# EAGLE board final_schematic (EAGLE 5.09), part 1 of 2
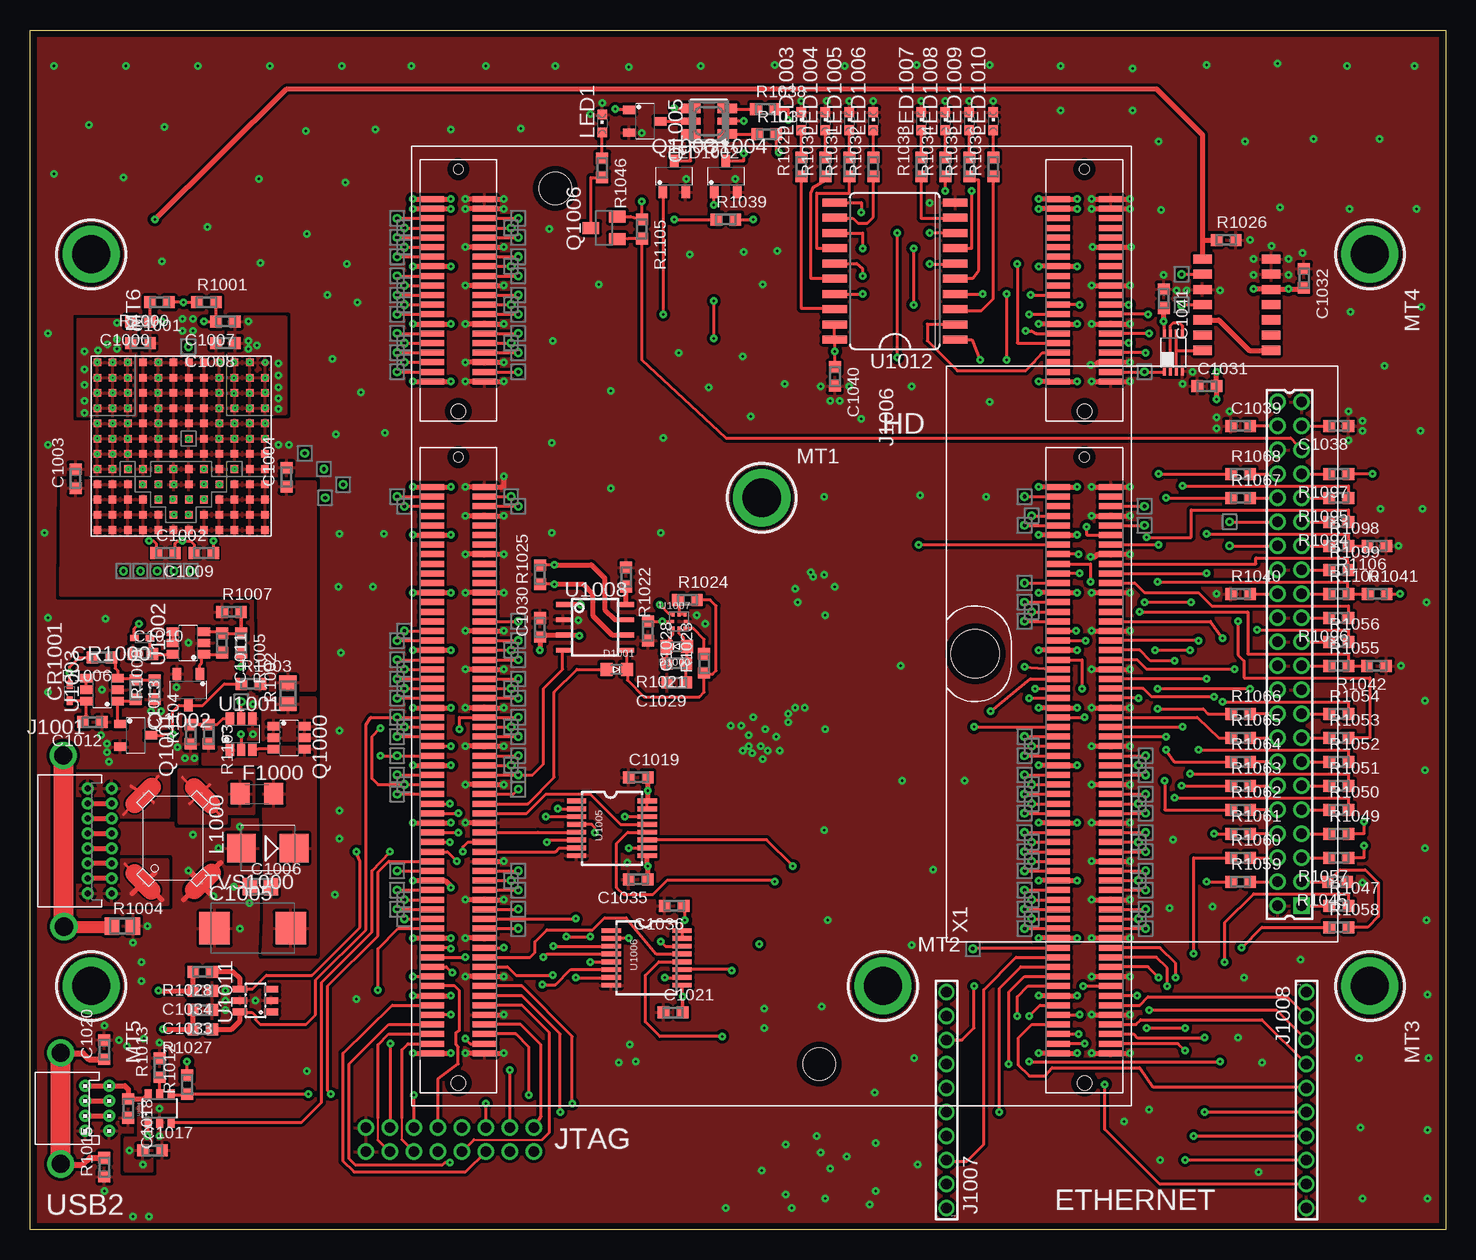
[diagram p5: board, top side]
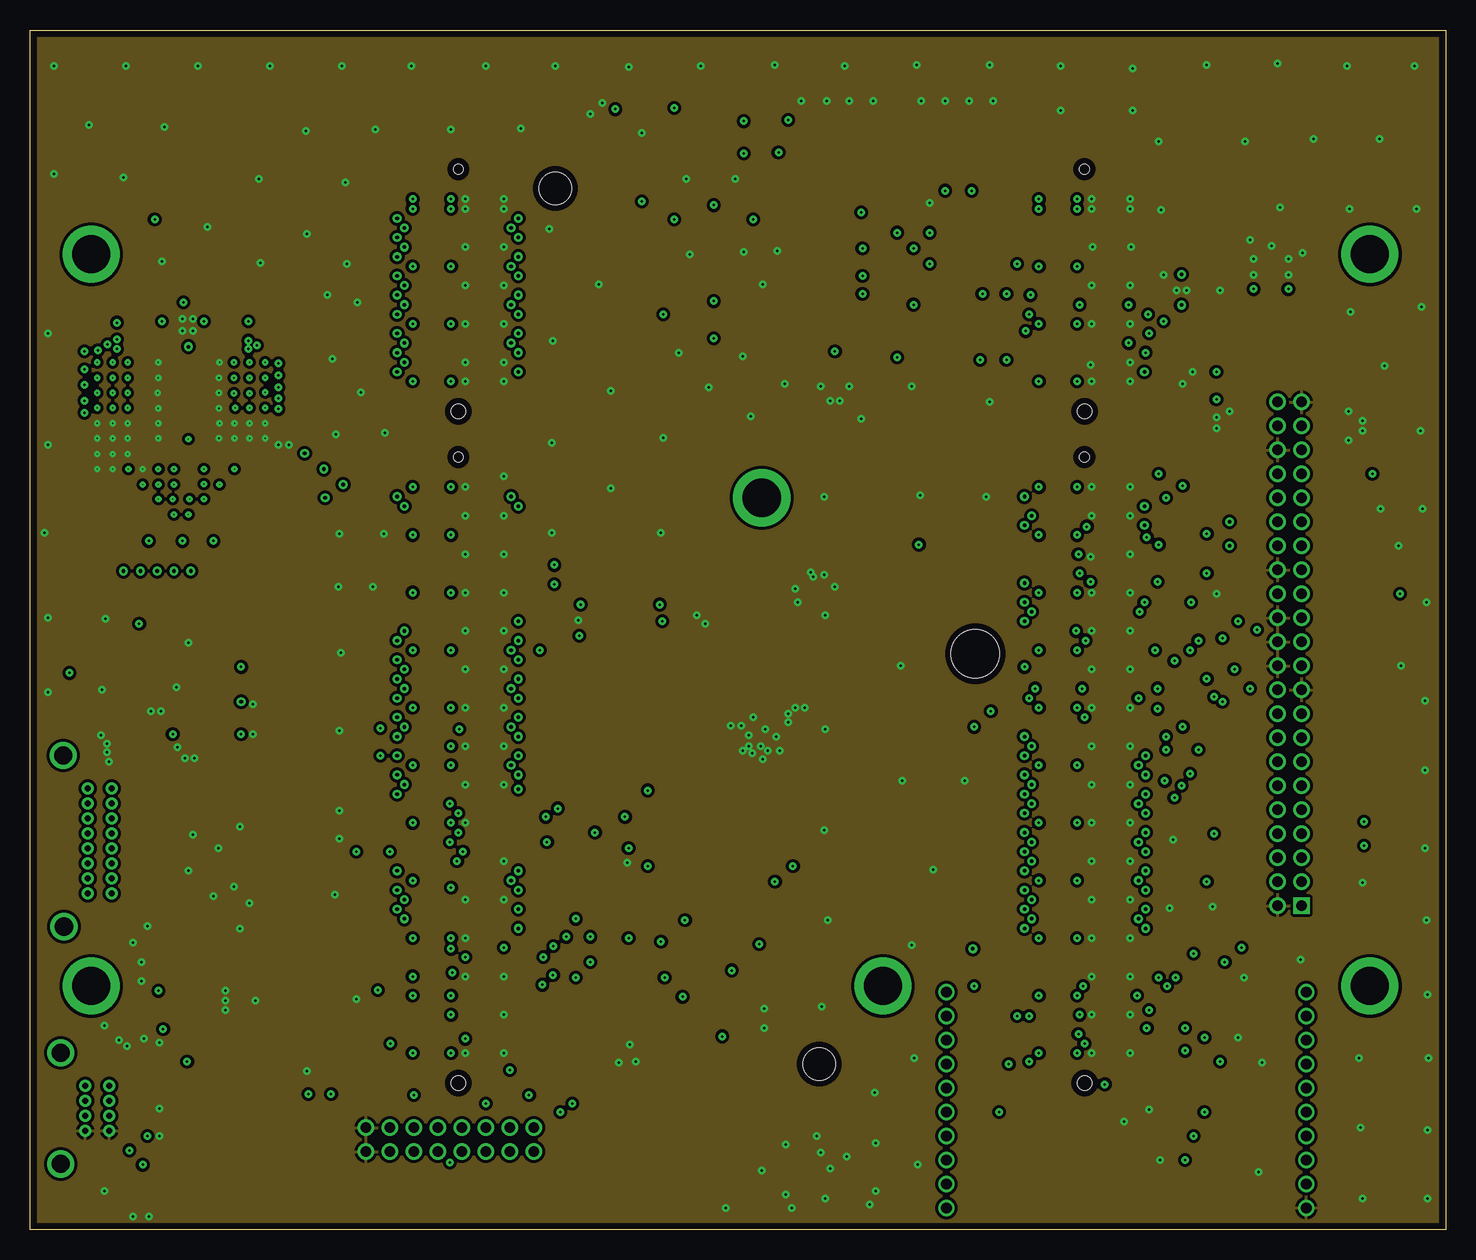
[diagram p6: board, inner layer Route2]
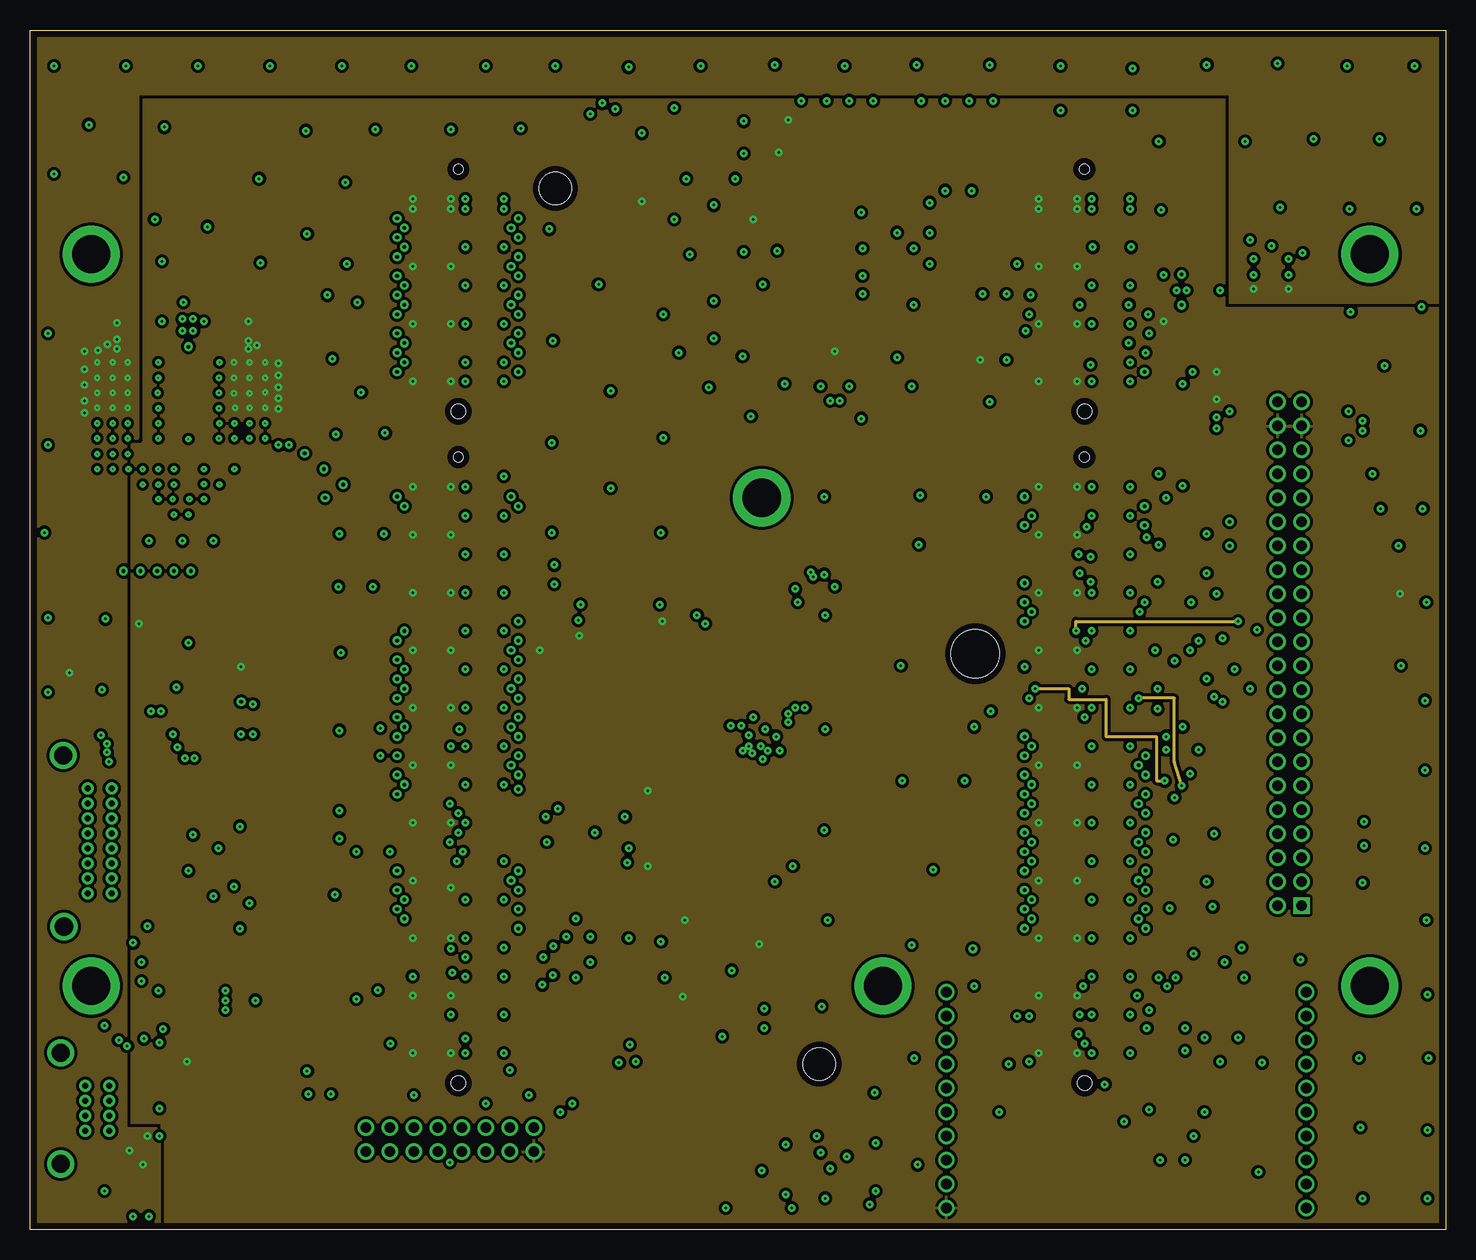
[diagram p7: board, inner layer Route3]
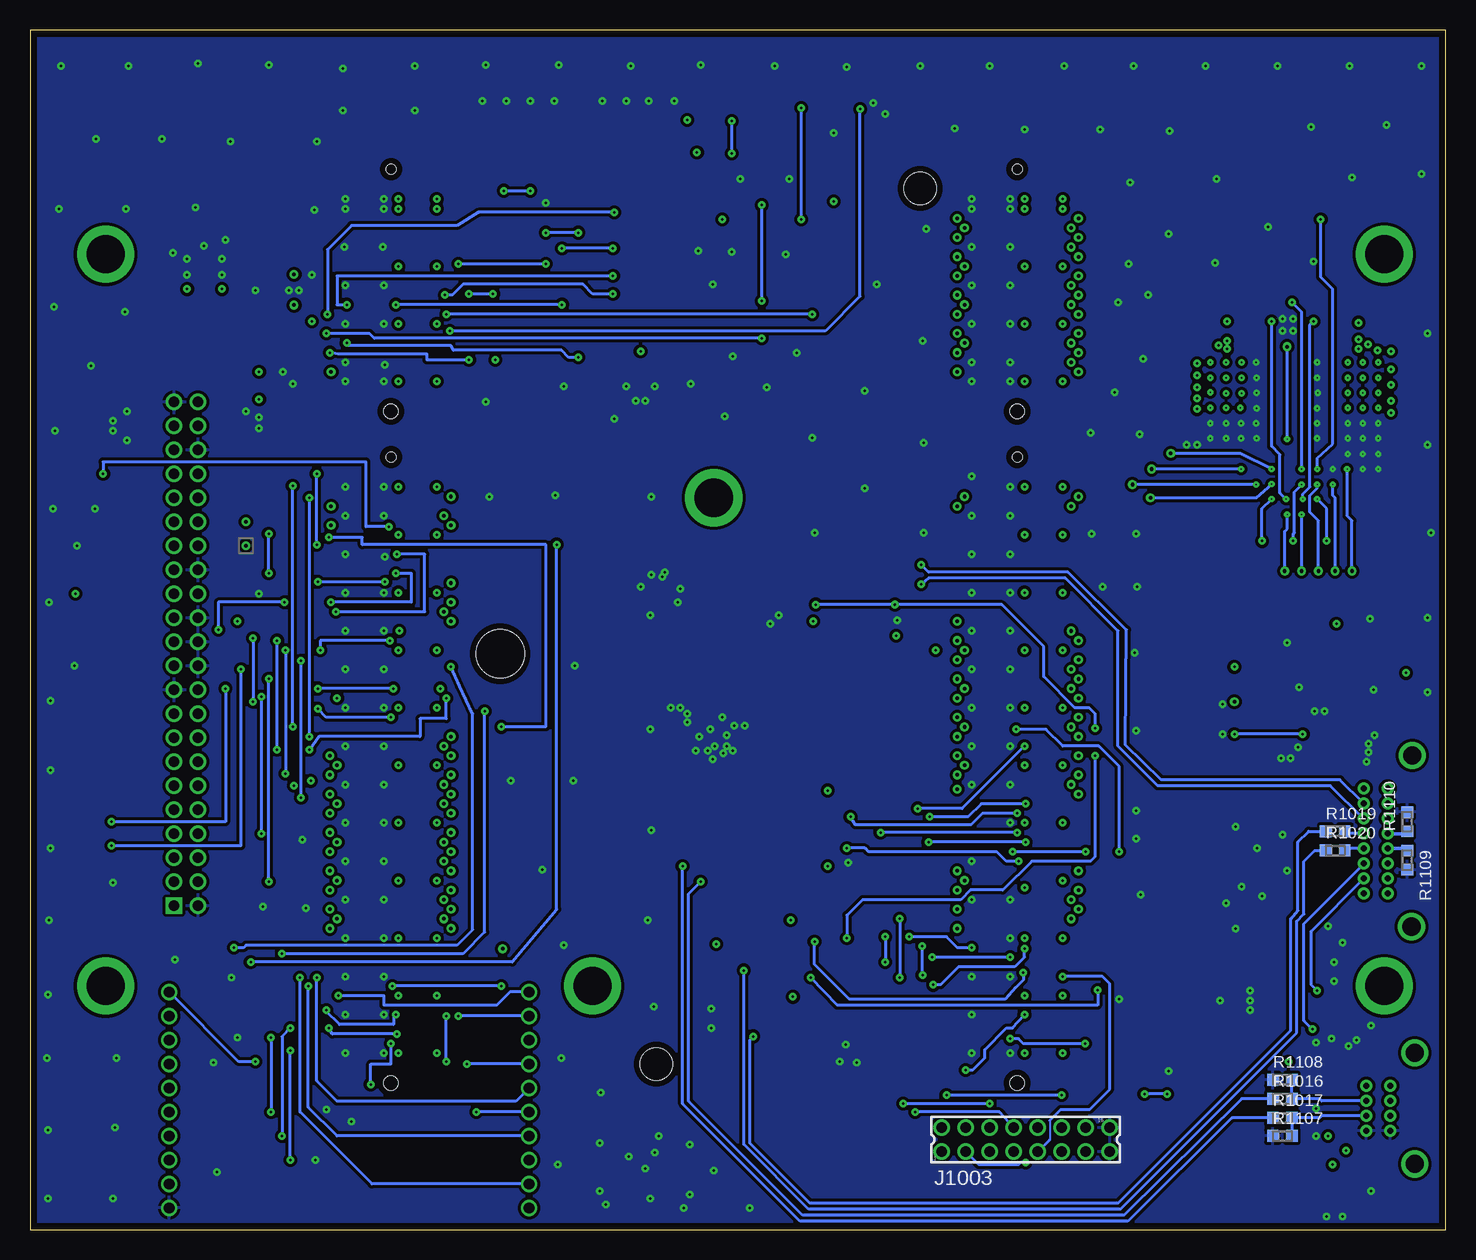
[diagram p8: board, bottom side, seen from below]

Size 118 x 100 mm. Coordinates in mm from the lower left corner, seen from the top.
Outline: 0,100 118,100 118,0 0,0 0,100
Copper layers (1+2*3+16): Top 0.0432mm / dielectric 0.3048mm / Route2 0.0356mm / dielectric 0.7112mm / Route3 0.0356mm / dielectric 0.3048mm / Bottom 0.0432mm
Design rules "sunstone_4lr_rules_v1.3_modifid": minimum track width 6mil, minimum drill 8mil, track to track 6mil, track to pad 6mil, pad to pad 6mil, via to via 6mil, smd to smd 6mil, copper to edge 20mil, drill to drill 16mil, minimum pad ring 0.2118mm, minimum via ring 0.2118mm, stop-mask expansion 3mil, vias tented up to drill 0mil, thermal gap 10mil

## Footprints (pad centres in the part's own frame; a part is rotated, then mirrored left to right if it is on the bottom)
0603-B-NOSILK = smd 0.95 x 1: 1 -0.8,0; 2 0.8,0
D/7343-31R = smd 2.55 x 2.7: + 3.175,0; - -3.175,0
0805-B-NOSILK = smd 1.15 x 1.45: 1 -0.9,0; 2 0.9,0
SOD523 = smd 0.7 x 0.5: A 0.7,0; C -0.6,0
0603-DIODE@1 = smd 1 x 1.1: A -0.85,0; K 0.85,0
1206 = smd 1.6 x 1.8: 1 -1.4,0; 2 1.4,0
ROCKETBUS-PKG = drill 0.508 pad 1.016 round: AUX_1@1 0,-1.875; AUX_1@2 2,-1.875; AUX_2@1 0,-3.125; AUX_2@2 2,-3.125; B+@1 0,4.375; B+@2 2,4.375; B-@1 0,-4.375; B-@2 2,-4.375; CAN_H@1 0,3.125; CAN_H@2 2,3.125; CAN_L@1 0,1.875; CAN_L@2 2,1.875; USB_H@1 0,0.625; USB_H@2 2,0.625; USB_L@1 0,-0.625; USB_L@2 2,-0.625 | drill 1.511 round: CHASSIS@1 -2.032,7.136; CHASSIS@2 -1.982,-7.136
87758-1616 = drill 0.9 pad 1.27 round: 1 -7,-1; 2 -7,1; 3 -5,-1; 4 -5,1; 5 -3,-1; 6 -3,1; 7 -1,-1; 8 -1,1; 9 1,-1; 10 1,1; 11 3,-1; 12 3,1; 13 5,-1; 14 5,1; 15 7,-1; 16 7,1
CAN_NODE = drill 0.508 pad 1.016 round: B+@1 2,1.875; B+@2 0,1.875; B-@7 2,-1.875; B-@8 0,-1.875; CANH@3 2,0.625; CANH@4 0,0.625; CANL@5 2,-0.625; CANL@6 0,-0.625 | drill 1.511 round: CHASSIS@1 -2.032,4.636; CHASSIS@2 -2.032,-4.636
TQM = smd 0.5 x 2: X1_1 -35.6,-23.9; X1_2 -35.6,-28.3; X1_3 -34.8,-23.9; X1_4 -34.8,-28.3; X1_5 -34,-23.9; X1_6 -34,-28.3; X1_7 -33.2,-23.9; X1_8 -33.2,-28.3; X1_9 -32.4,-23.9; X1_10 -32.4,-28.3; X1_11 -31.6,-23.9; X1_12 -31.6,-28.3; X1_13 -30.8,-23.9; X1_14 -30.8,-28.3; X1_15 -30,-23.9; X1_16 -30,-28.3; X1_17 -29.2,-23.9; X1_18 -29.2,-28.3; X1_19 -28.4,-23.9; X1_20 -28.4,-28.3; X1_21 -27.6,-23.9; X1_22 -27.6,-28.3; X1_23 -26.8,-23.9; X1_24 -26.8,-28.3; X1_25 -26,-23.9; X1_26 -26,-28.3; X1_27 -25.2,-23.9; X1_28 -25.2,-28.3; X1_29 -24.4,-23.9; X1_30 -24.4,-28.3; X1_31 -23.6,-23.9; X1_32 -23.6,-28.3; X1_33 -22.8,-23.9; X1_34 -22.8,-28.3; X1_35 -22,-23.9; X1_36 -22,-28.3; X1_37 -21.2,-23.9; X1_38 -21.2,-28.3; X1_39 -20.4,-23.9; X1_40 -20.4,-28.3; X1_41 -19.6,-23.9; X1_42 -19.6,-28.3; X1_43 -18.8,-23.9; X1_44 -18.8,-28.3; X1_45 -18,-23.9; X1_46 -18,-28.3; X1_47 -17.2,-23.9; X1_48 -17.2,-28.3; X1_49 -16.4,-23.9; X1_50 -16.4,-28.3; X1_51 -15.6,-23.9; X1_52 -15.6,-28.3; X1_53 -14.8,-23.9; X1_54 -14.8,-28.3; X1_55 -14,-23.9; X1_56 -14,-28.3; X1_57 -13.2,-23.9; X1_58 -13.2,-28.3; X1_59 -12.4,-23.9; X1_60 -12.4,-28.3; X1_61 -11.6,-23.9; X1_62 -11.6,-28.3; X1_63 -10.8,-23.9; X1_64 -10.8,-28.3; X1_65 -10,-23.9; X1_66 -10,-28.3; X1_67 -9.2,-23.9; X1_68 -9.2,-28.3; X1_69 -8.4,-23.9; X1_70 -8.4,-28.3; X1_71 -7.6,-23.9; X1_72 -7.6,-28.3; X1_73 -6.8,-23.9; X1_74 -6.8,-28.3; X1_75 -6,-23.9; X1_76 -6,-28.3; X1_77 -5.2,-23.9; X1_78 -5.2,-28.3; X1_79 -4.4,-23.9; X1_80 -4.4,-28.3; X1_81 -3.6,-23.9; X1_82 -3.6,-28.3; X1_83 -2.8,-23.9; X1_84 -2.8,-28.3; X1_85 -2,-23.9; X1_86 -2,-28.3; X1_87 -1.2,-23.9; X1_88 -1.2,-28.3; X1_89 -0.4,-23.9; X1_90 -0.4,-28.3; X1_91 0.4,-23.9; X1_92 0.4,-28.3; X1_93 1.2,-23.9; X1_94 1.2,-28.3; X1_95 2,-23.9; X1_96 2,-28.3; X1_97 2.8,-23.9; X1_98 2.8,-28.3; X1_99 3.6,-23.9; X1_100 3.6,-28.3; X1_101 4.4,-23.9; X1_102 4.4,-28.3; X1_103 5.2,-23.9; X1_104 5.2,-28.3; X1_105 6,-23.9; X1_106 6,-28.3; X1_107 6.8,-23.9; X1_108 6.8,-28.3; X1_109 7.6,-23.9; X1_110 7.6,-28.3; X1_111 8.4,-23.9; X1_112 8.4,-28.3; X1_113 9.2,-23.9; X1_114 9.2,-28.3; X1_115 10,-23.9; X1_116 10,-28.3; X1_117 10.8,-23.9; X1_118 10.8,-28.3; X1_119 11.6,-23.9; X1_120 11.6,-28.3; X2_1 20.4,-23.9; X2_2 20.4,-28.3; X2_3 21.2,-23.9; X2_4 21.2,-28.3; X2_5 22,-23.9; X2_6 22,-28.3; X2_7 22.8,-23.9; X2_8 22.8,-28.3; X2_9 23.6,-23.9; X2_10 23.6,-28.3; X2_11 24.4,-23.9; X2_12 24.4,-28.3; X2_13 25.2,-23.9; X2_14 25.2,-28.3; X2_15 26,-23.9; X2_16 26,-28.3; X2_17 26.8,-23.9; X2_18 26.8,-28.3; X2_19 27.6,-23.9; X2_20 27.6,-28.3; X2_21 28.4,-23.9; X2_22 28.4,-28.3; X2_23 29.2,-23.9; X2_24 29.2,-28.3; X2_25 30,-23.9; X2_26 30,-28.3; X2_27 30.8,-23.9; X2_28 30.8,-28.3; X2_29 31.6,-23.9; X2_30 31.6,-28.3; X2_31 32.4,-23.9; X2_32 32.4,-28.3; X2_33 33.2,-23.9; X2_34 33.2,-28.3; X2_35 34,-23.9; X2_36 34,-28.3; X2_37 34.8,-23.9; X2_38 34.8,-28.3; X2_39 35.6,-23.9; X2_40 35.6,-28.3; X3_1 -35.6,28.3; X3_2 -35.6,23.9; X3_3 -34.8,28.3; X3_4 -34.8,23.9; X3_5 -34,28.3; X3_6 -34,23.9; X3_7 -33.2,28.3; X3_8 -33.2,23.9; X3_9 -32.4,28.3; X3_10 -32.4,23.9; X3_11 -31.6,28.3; X3_12 -31.6,23.9; X3_13 -30.8,28.3; X3_14 -30.8,23.9; X3_15 -30,28.3; X3_16 -30,23.9; X3_17 -29.2,28.3; X3_18 -29.2,23.9; X3_19 -28.4,28.3; X3_20 -28.4,23.9; X3_21 -27.6,28.3; X3_22 -27.6,23.9; X3_23 -26.8,28.3; X3_24 -26.8,23.9; X3_25 -26,28.3; X3_26 -26,23.9; X3_27 -25.2,28.3; X3_28 -25.2,23.9; X3_29 -24.4,28.3; X3_30 -24.4,23.9; X3_31 -23.6,28.3; X3_32 -23.6,23.9; X3_33 -22.8,28.3; X3_34 -22.8,23.9; X3_35 -22,28.3; X3_36 -22,23.9; X3_37 -21.2,28.3; X3_38 -21.2,23.9; X3_39 -20.4,28.3; X3_40 -20.4,23.9; X3_41 -19.6,28.3; X3_42 -19.6,23.9; X3_43 -18.8,28.3; X3_44 -18.8,23.9; X3_45 -18,28.3; X3_46 -18,23.9; X3_47 -17.2,28.3; X3_48 -17.2,23.9; X3_49 -16.4,28.3; X3_50 -16.4,23.9; X3_51 -15.6,28.3; X3_52 -15.6,23.9; X3_53 -14.8,28.3; X3_54 -14.8,23.9; X3_55 -14,28.3; X3_56 -14,23.9; X3_57 -13.2,28.3; X3_58 -13.2,23.9; X3_59 -12.4,28.3; X3_60 -12.4,23.9; X3_61 -11.6,28.3; X3_62 -11.6,23.9; X3_63 -10.8,28.3; X3_64 -10.8,23.9; X3_65 -10,28.3; X3_66 -10,23.9; X3_67 -9.2,28.3; X3_68 -9.2,23.9; X3_69 -8.4,28.3; X3_70 -8.4,23.9; X3_71 -7.6,28.3; X3_72 -7.6,23.9; X3_73 -6.8,28.3; X3_74 -6.8,23.9; X3_75 -6,28.3; X3_76 -6,23.9; X3_77 -5.2,28.3; X3_78 -5.2,23.9; X3_79 -4.4,28.3; X3_80 -4.4,23.9; X3_81 -3.6,28.3; X3_82 -3.6,23.9; X3_83 -2.8,28.3; X3_84 -2.8,23.9; X3_85 -2,28.3; X3_86 -2,23.9; X3_87 -1.2,28.3; X3_88 -1.2,23.9; X3_89 -0.4,28.3; X3_90 -0.4,23.9; X3_91 0.4,28.3; X3_92 0.4,23.9; X3_93 1.2,28.3; X3_94 1.2,23.9; X3_95 2,28.3; X3_96 2,23.9; X3_97 2.8,28.3; X3_98 2.8,23.9; X3_99 3.6,28.3; X3_100 3.6,23.9; X3_101 4.4,28.3; X3_102 4.4,23.9; X3_103 5.2,28.3; X3_104 5.2,23.9; X3_105 6,28.3; X3_106 6,23.9; X3_107 6.8,28.3; X3_108 6.8,23.9; X3_109 7.6,28.3; X3_110 7.6,23.9; X3_111 8.4,28.3; X3_112 8.4,23.9; X3_113 9.2,28.3; X3_114 9.2,23.9; X3_115 10,28.3; X3_116 10,23.9; X3_117 10.8,28.3; X3_118 10.8,23.9; X3_119 11.6,28.3; X3_120 11.6,23.9; X4_1 20.4,28.3; X4_2 20.4,23.9; X4_3 21.2,28.3; X4_4 21.2,23.9; X4_5 22,28.3; X4_6 22,23.9; X4_7 22.8,28.3; X4_8 22.8,23.9; X4_9 23.6,28.3; X4_10 23.6,23.9; X4_11 24.4,28.3; X4_12 24.4,23.9; X4_13 25.2,28.3; X4_14 25.2,23.9; X4_15 26,28.3; X4_16 26,23.9; X4_17 26.8,28.3; X4_18 26.8,23.9; X4_19 27.6,28.3; X4_20 27.6,23.9; X4_21 28.4,28.3; X4_22 28.4,23.9; X4_23 29.2,28.3; X4_24 29.2,23.9; X4_25 30,28.3; X4_26 30,23.9; X4_27 30.8,28.3; X4_28 30.8,23.9; X4_29 31.6,28.3; X4_30 31.6,23.9; X4_31 32.4,28.3; X4_32 32.4,23.9; X4_33 33.2,28.3; X4_34 33.2,23.9; X4_35 34,28.3; X4_36 34,23.9; X4_37 34.8,28.3; X4_38 34.8,23.9; X4_39 35.6,28.3; X4_40 35.6,23.9 | hole 1.2: 17.9,-26.1; 17.9,26.1; -38.1,-26.1; -38.1,26.1 | hole 0.8: 38.1,-26.1; 38.1,26.1; 14.1,-26.1; 14.1,26.1 | hole 2.7: -36.5,-4; 36.5,18
1_10_CON = drill 0.9 pad 1.27 round: 1 -9,0; 2 -7,0; 3 -5,0; 4 -3,0; 5 -1,0; 6 1,0; 7 3,0; 8 5,0; 9 7,0; 10 9,0
CMS1 = smd 0.254 x 0.254: 1 3.708,-2.362; 2 3.708,2.362; 3 -3.708,2.362; 4 -3.708,-2.362
CHIPLED_0603 = smd 0.8 x 0.8: A 0,-0.75; C 0,0.75
PLCC-6 = smd 1.65 x 0.8: 1 -1.525,1.05; 3 -1.525,-1.05; 4 1.525,-1.05; 6 1.525,1.05 | smd 1.65 x 0.6: 2 -1.525,0; 5 1.525,0
#4/.225-PAD+HEAD_OR_SMALL_NUT = drill 3.175 round: MT 0,0
SOT23-6 = smd 0.7 x 1: 1 -0.95,-1.3; 2 0,-1.3; 3 0.95,-1.3; 4 0.95,1.3; 5 0,1.3; 6 -0.95,1.3
SOT23-3 = smd 0.7 x 1: 1 -0.95,-1.3; 2 0.95,-1.3; 3 0,1.3
SOT23 = smd 1 x 1.4: 1 -0.95,-1.1; 2 0.95,-1.1; 3 0,1.1
TEST = drill 0.3 round: P$1 0,0
SMB = smd 2.4 x 2.4: A 2.2,0; C -2.2,0
LT4619 = smd 0.63 x 0.63: A1 -6.985,-6.985; A2 -5.715,-6.985; A3 -4.445,-6.985; A4 -3.175,-6.985; A5 -1.905,-6.985; A6 -0.635,-6.985; A7 0.635,-6.985; A8 1.905,-6.985; A9 3.175,-6.985; A10 4.445,-6.985; A11 5.715,-6.985; A12 6.985,-6.985; B1 -6.985,-5.715; B2 -5.715,-5.715; B3 -4.445,-5.715; B4 -3.175,-5.715; B5 -1.905,-5.715; B6 -0.635,-5.715; B7 0.635,-5.715; B8 1.905,-5.715; B9 3.175,-5.715; B10 4.445,-5.715; B11 5.715,-5.715; B12 6.985,-5.715; C1 -6.985,-4.445; C2 -5.715,-4.445; C3 -4.445,-4.445; C4 -3.175,-4.445; C5 -1.905,-4.445; C6 -0.635,-4.445; C7 0.635,-4.445; C8 1.905,-4.445; C9 3.175,-4.445; C10 4.445,-4.445; C11 5.715,-4.445; C12 6.985,-4.445; D1 -6.985,-3.175; D2 -5.715,-3.175; D3 -4.445,-3.175; D4 -3.175,-3.175; D5 -1.905,-3.175; D6 -0.635,-3.175; D7 0.635,-3.175; D8 1.905,-3.175; D9 3.175,-3.175; D10 4.445,-3.175; D11 5.715,-3.175; D12 6.985,-3.175; E1 -6.985,-1.905; E2 -5.715,-1.905; E3 -4.445,-1.905; E4 -3.175,-1.905; E5 -1.905,-1.905; E6 -0.635,-1.905; E7 0.635,-1.905; E8 1.905,-1.905; E9 3.175,-1.905; E10 4.445,-1.905; E11 5.715,-1.905; E12 6.985,-1.905; F1 -6.985,-0.635; F2 -5.715,-0.635; F3 -4.445,-0.635; F4 -3.175,-0.635; F5 -1.905,-0.635; F6 -0.635,-0.635; F7 0.635,-0.635; F8 1.905,-0.635; F9 3.175,-0.635; F10 4.445,-0.635; F11 5.715,-0.635; F12 6.985,-0.635; G1 -6.985,0.635; G2 -5.715,0.635; G3 -4.445,0.635; G4 -3.175,0.635; G5 -1.905,0.635; G6 -0.635,0.635; G7 0.635,0.635; G8 1.905,0.635; G9 3.175,0.635; G10 4.445,0.635; G11 5.715,0.635; G12 6.985,0.635; H1 -6.985,1.905; H2 -5.715,1.905; H3 -4.445,1.905; H4 -3.175,1.905; H5 -1.905,1.905; H6 -0.635,1.905; H7 0.635,1.905; H8 1.905,1.905; H9 3.175,1.905; H10 4.445,1.905; H11 5.715,1.905; H12 6.985,1.905; J1 -6.985,3.175; J2 -5.715,3.175; J3 -4.445,3.175; J4 -3.175,3.175; J5 -1.905,3.175; J6 -0.635,3.175; J7 0.635,3.175; J8 1.905,3.175; J9 3.175,3.175; J10 4.445,3.175; J11 5.715,3.175; J12 6.985,3.175; K1 -6.985,4.445; K2 -5.715,4.445; K3 -4.445,4.445; K4 -3.175,4.445; K5 -1.905,4.445; K6 -0.635,4.445; K7 0.635,4.445; K8 1.905,4.445; K9 3.175,4.445; K10 4.445,4.445; K11 5.715,4.445; K12 6.985,4.445; L1 -6.985,5.715; L2 -5.715,5.715; L3 -4.445,5.715; L4 -3.175,5.715; L5 -1.905,5.715; L6 -0.635,5.715; L7 0.635,5.715; L8 1.905,5.715; L9 3.175,5.715; L10 4.445,5.715; L11 5.715,5.715; L12 6.985,5.715; M1 -6.985,6.985; M2 -5.715,6.985; M3 -4.445,6.985; M4 -3.175,6.985; M5 -1.905,6.985; M6 -0.635,6.985; M7 0.635,6.985; M8 1.905,6.985; M9 3.175,6.985; M10 4.445,6.985; M11 5.715,6.985; M12 6.985,6.985
USB_PWR_SWT_SOP = smd 0.6 x 0.9: 1 -0.938,-1.151; 2 0.012,-1.151; 3 0.962,-1.151; 4 0.962,1.149; 5 0.012,1.149; 6 -0.938,1.149
USB_TRANCEIVER = smd 0.4 x 1.6: 1 -2.225,-2.85; 2 -1.575,-2.85; 3 -0.925,-2.85; 4 -0.275,-2.85; 5 0.375,-2.85; 6 1.025,-2.85; 7 1.675,-2.85; 8 2.325,-2.85; 9 2.325,3.05; 10 1.675,3.05; 11 1.025,3.05; 12 0.375,3.05; 13 -0.275,3.05; 14 -0.925,3.05; 15 -1.575,3.05; 16 -2.225,3.05
MICROPAK-8 = smd 0.25 x 0.4: 1 -0.5,-0.61; 2 0,-0.61; 3 0.5,-0.61; 5 0.5,0.61; 6 0,0.61; 7 -0.5,0.61 | smd 0.4 x 0.25: 4 0.6,0; 8 -0.6,0
DR-PDSO-G8 = smd 0.4 x 1.2: 1 -1.905,-2.65; 2 -0.635,-2.65; 3 0.635,-2.65; 4 1.905,-2.65; 5 1.905,2.65; 6 0.635,2.65; 7 -0.635,2.65; 8 -1.905,2.65
SN74LVC2G80DCU = smd 0.25 x 0.75: 1 -0.75,-1.55; 2 -0.25,-1.55; 3 0.25,-1.55; 4 0.75,-1.55; 5 0.75,1.55; 6 0.25,1.55; 7 -0.25,1.55; 8 -0.75,1.55
SN74LS92 = smd 0.76 x 1.52: 1 -3.81,-2.86; 2 -2.54,-2.86; 3 -1.27,-2.86; 4 0,-2.86; 5 1.27,-2.86; 6 2.54,-2.86; 7 3.81,-2.86; 8 3.81,2.86; 9 2.54,2.86; 10 1.27,2.86; 11 0,2.86; 12 -1.27,2.86; 13 -2.54,2.86; 14 -3.81,2.86
SOT23-6L = smd 0.55 x 1.2: 1 -0.95,-1.3; 2 0,-1.3; 3 0.95,-1.3; 4 0.95,1.3; 5 0,1.3; 6 -0.95,1.3
SO20W = smd 0.66 x 2.032: 1 -5.715,-5.029; 2 -4.445,-5.029; 3 -3.175,-5.029; 4 -1.905,-5.029; 5 -0.635,-5.029; 6 0.635,-5.029; 7 1.905,-5.029; 8 3.175,-5.029; 9 4.445,-5.029; 10 5.715,-5.029; 11 5.715,5.029; 12 4.445,5.029; 13 3.175,5.029; 14 1.905,5.029; 15 0.635,5.029; 16 -0.635,5.029; 17 -1.905,5.029; 18 -3.175,5.029; 19 -4.445,5.029; 20 -5.715,5.029
IDE_CON_P = drill 0.9 pad 1.27 square: 1 0,0 | drill 0.9 pad 1.27 round: 2 0,2; 3 2,0; 4 2,2; 5 4,0; 6 4,2; 7 6,0; 8 6,2; 9 8,0; 10 8,2; 11 10,0; 12 10,2; 13 12,0; 14 12,2; 15 14,0; 16 14,2; 17 16,0; 18 16,2; 19 18,0; 20 18,2; 21 20,0; 22 20,2; 23 22,0; 24 22,2; 25 24,0; 26 24,2; 27 26,0; 28 26,2; 29 28,0; 30 28,2; 31 30,0; 32 30,2; 33 32,0; 34 32,2; 35 34,0; 36 34,2; 37 36,0; 38 36,2; 39 38,0; 40 38,2; 41 40,0; 42 40,2; 43 42,0; 44 42,2 | hole 4: 21,27.2

## Placement (x,y rotation side)
C1000  22p  [0603-B-NOSILK]  9.2,75.7 180 top
C1001  100u  [0603-B-NOSILK]  9.2,73.9 0 top
C1002  0.2n  [0603-B-NOSILK]  11.3,56.4 0 top
C1003  10u  [0603-B-NOSILK]  3.8,62.6 90 top
C1004  10u  [0603-B-NOSILK]  21.38,62.72 90 top
C1005  22u  [D/7343-31R]  18.56,25.11 0 top
C1006  0.33  [0805-B-NOSILK]  19.2,28.6 0 top
C1007  22p  [0603-B-NOSILK]  16.3,75.7 180 top
C1008  100u  [0603-B-NOSILK]  16.3,73.9 180 top
C1009  0.2n  [0603-B-NOSILK]  14.5,56.4 180 top
C1010  2.7u  [0603-B-NOSILK]  9.4,48 0 top
C1011  15n  [0603-B-NOSILK]  16,48.9 270 top
C1012  2.7u  [0603-B-NOSILK]  5.2,42.3 180 top
C1013  15n  [0603-B-NOSILK]  8.8,45 270 top
C1017  10u  [0603-B-NOSILK]  10.2,6.6 0 top
C1018  100nF  [0603-B-NOSILK]  8.2,10.1 270 top
C1019  100nF  [0603-B-NOSILK]  50.7,37.7 0 top
C1020  100nF  [0603-B-NOSILK]  6.2,15 90 top
C1021  100 nF  [0603-B-NOSILK]  53.6,18.1 0 top
C1028  100nF  [0603-B-NOSILK]  51.5,49.9 270 top
C1029  76nF  [0603-B-NOSILK]  53.9,45.6 180 top
C1030  100nF  [0603-B-NOSILK]  42.5,50.2 90 top
C1031  100nF  [0603-B-NOSILK]  98.1,70.3 0 top
C1032  100nF  [0603-B-NOSILK]  106.2,79.3 270 top
C1033  NP  [0603-B-NOSILK]  14.4,18.3 180 top
C1034  NP  [0603-B-NOSILK]  14.4,19.9 180 top
C1035  100nF  [0603-B-NOSILK]  50.7,29.2 180 top
C1036  100 nF  [0603-B-NOSILK]  53.7,27 180 top
C1038  100uF  [0603-B-NOSILK]  109.1,67 180 top
C1039  100nF  [0603-B-NOSILK]  100.9,67 0 top
C1040  100nF  [0603-B-NOSILK]  67.1,71.11 270 top
C1041  100nF  [0603-B-NOSILK]  94.5,77.6 270 top
CR1000  RB751S40  [SOD523]  9.4,49.3 180 top
CR1001  RB751S40  [SOD523]  3.3,44.7 90 top
D1000  CDSU101A  [0603-DIODE@1]  53.9,48.6 180 top
D1001  CDSU101A  [0603-DIODE@1]  48.9,46.7 0 top
F1000  2.0A Fast  [1206]  18.92,36.32 0 top
J1001  ROCKETBUS  [ROCKETBUS-PKG]  4.81,32.39 0 top
J1003  87758-1616  [87758-1616]  35,7.5 0 bottom
J1005  CONN_CAN_NODE  [CAN_NODE]  4.6,10.1 0 top
J1006  TQM  [TQM]  61.8,50.3 90 top
J1007  1_10_CON  [1_10_CON]  76.4,10.8 90 top
J1008  1_10_CON  [1_10_CON]  106.4,10.8 270 top
L1000  CMS1  [CMS1]  11.9,32.6 270 top
LED1  RED  [CHIPLED_0603]  47.7,92.2 0 top
LED1002  RGB  [PLCC-6]  56.6,92.4 180 top
LED1003  RED  [CHIPLED_0603]  64.3,92.4 0 top
LED1004  RED  [CHIPLED_0603]  66.3,92.4 0 top
LED1005  RED  [CHIPLED_0603]  68.3,92.4 0 top
LED1006  RED  [CHIPLED_0603]  70.3,92.4 0 top
LED1007  RED  [CHIPLED_0603]  74.3,92.4 0 top
LED1008  RED  [CHIPLED_0603]  76.3,92.4 0 top
LED1009  RED  [CHIPLED_0603]  78.3,92.4 0 top
LED1010  RED  [CHIPLED_0603]  80.3,92.4 0 top
MT1  #4-PLATED_MOUNTING_HOLE-P/.300  [#4/.225-PAD+HEAD_OR_SMALL_NUT]  61,61 0 top
MT2  #4-PLATED_MOUNTING_HOLE-P/.300  [#4/.225-PAD+HEAD_OR_SMALL_NUT]  71.1,20.3 0 top
MT3  #4-PLATED_MOUNTING_HOLE-P/.300  [#4/.225-PAD+HEAD_OR_SMALL_NUT]  111.7,20.3 270 top
MT4  #4-PLATED_MOUNTING_HOLE-P/.300  [#4/.225-PAD+HEAD_OR_SMALL_NUT]  111.7,81.3 270 top
MT5  #4-PLATED_MOUNTING_HOLE-P/.300  [#4/.225-PAD+HEAD_OR_SMALL_NUT]  5.1,20.3 270 top
MT6  #4-PLATED_MOUNTING_HOLE-P/.300  [#4/.225-PAD+HEAD_OR_SMALL_NUT]  5.1,81.3 270 top
Q1000  ZXMP6A17E6TA  [SOT23-6]  21.6,41 270 top
Q1001  BSS123E6327  [SOT23-3]  8.8,41.2 270 top
Q1002  BSS123E6327  [SOT23-3]  13.2,45 180 top
Q1003  BSS123E6327  [SOT23-3]  53.7,87.8 0 top
Q1004  BSS123E6327  [SOT23-3]  58,87.8 0 top
Q1005  BSS123E6327  [SOT23-3]  51.25,92.39 270 top
Q1006  BSS84  [SOT23]  47.85,83.5 90 top
R1000  11.5K  [0603-B-NOSILK]  10.8,77.3 180 top
R1001  19.1K  [0603-B-NOSILK]  14.7,77.3 0 top
R1002  0.06  [0805-B-NOSILK]  21.5,44.7 90 top
R1003  47k  [0603-B-NOSILK]  18.4,45.5 0 top
R1004  100k  [0805-B-NOSILK]  7.7,25.3 0 top
R1005  19.1k  [0603-B-NOSILK]  17.6,48.9 270 top
R1006  34k  [0603-B-NOSILK]  6,47.7 180 top
R1007  10.0k  [0603-B-NOSILK]  16.8,51.5 0 top
R1008  10.0k  [0603-B-NOSILK]  10.4,45 90 top
R1012  10K  [0603-B-NOSILK]  13.1,12.1 90 top
R1013  57K  [0603-B-NOSILK]  10.8,13.5 90 top
R1015  100K  [0603-B-NOSILK]  6.2,5.2 90 top
R1016  33  [0603-B-NOSILK]  13.6,10.9 0 bottom
R1017  33  [0603-B-NOSILK]  13.6,9.3 0 bottom
R1019  33  [0603-B-NOSILK]  9.2,33.2 0 bottom
R1020  33  [0603-B-NOSILK]  9.2,31.6 0 bottom
R1021  10k  [0603-B-NOSILK]  53.9,47.2 180 top
R1022  18k  [0603-B-NOSILK]  49.7,54.4 270 top
R1023  3.3K  [0603-B-NOSILK]  56.2,47.2 90 top
R1024  NP  [0603-B-NOSILK]  54.8,52.5 0 top
R1025  60  [0603-B-NOSILK]  42.5,54.6 90 top
R1026  100k  [0603-B-NOSILK]  99.7,82.5 0 top
R1027  0  [0603-B-NOSILK]  14.4,16.7 180 top
R1028  0  [0603-B-NOSILK]  14.4,21.5 180 top
R1029  150  [0603-B-NOSILK]  64.3,88.6 90 top
R1030  150  [0603-B-NOSILK]  66.3,88.6 90 top
R1031  150  [0603-B-NOSILK]  68.3,88.6 90 top
R1032  150  [0603-B-NOSILK]  70.3,88.6 90 top
R1033  150  [0603-B-NOSILK]  74.3,88.6 90 top
R1034  150  [0603-B-NOSILK]  76.3,88.6 90 top
R1035  150  [0603-B-NOSILK]  78.3,88.6 90 top
R1036  150  [0603-B-NOSILK]  80.3,88.6 90 top
R1037  2.32K  [0603-B-NOSILK]  61.4,91.3 0 top
R1038  2.32K  [0603-B-NOSILK]  61.3,93.4 0 top
R1039  3.83K  [0603-B-NOSILK]  58,84.2 0 top
R1040  82  [0603-B-NOSILK]  100.9,53 0 top
R1041  4.7K  [0603-B-NOSILK]  112.3,53 0 top
R1042  10k  [0603-B-NOSILK]  112.25,47 180 top
R1045  10k  [0603-B-NOSILK]  109,29 180 top
R1046  80  [0603-B-NOSILK]  47.7,88.5 270 top
R1047  33  [0603-B-NOSILK]  109.1,27 0 top
R1049  33  [0603-B-NOSILK]  109.1,33 0 top
R1050  33  [0603-B-NOSILK]  109.1,35 0 top
R1051  33  [0603-B-NOSILK]  109.1,37 0 top
R1052  33  [0603-B-NOSILK]  109.1,39 0 top
R1053  33  [0603-B-NOSILK]  109.1,41 0 top
R1054  33  [0603-B-NOSILK]  109.1,43 0 top
R1055  82  [0603-B-NOSILK]  109.1,47 0 top
R1056  22  [0603-B-NOSILK]  109.1,49 0 top
R1057  33  [0603-B-NOSILK]  109.1,31 180 top
R1058  33  [0603-B-NOSILK]  109.1,25.2 0 top
R1059  33  [0603-B-NOSILK]  100.9,29 0 top
R1060  33  [0603-B-NOSILK]  100.9,31 0 top
R1061  33  [0603-B-NOSILK]  100.9,33 0 top
R1062  33  [0603-B-NOSILK]  100.9,35 0 top
R1063  33  [0603-B-NOSILK]  100.9,37 0 top
R1064  33  [0603-B-NOSILK]  100.9,39 0 top
R1065  33  [0603-B-NOSILK]  100.9,41 0 top
R1066  33  [0603-B-NOSILK]  100.9,43 0 top
R1067  33  [0603-B-NOSILK]  100.9,61 0 top
R1068  33  [0603-B-NOSILK]  100.9,63 0 top
R1094  33  [0603-B-NOSILK]  109.1,59 180 top
R1095  33  [0603-B-NOSILK]  109.1,61 180 top
R1096  22  [0603-B-NOSILK]  109.1,51 180 top
R1097  33  [0603-B-NOSILK]  109.1,63 180 top
R1098  82  [0603-B-NOSILK]  109.1,57 0 top
R1099  22  [0603-B-NOSILK]  109.1,55 0 top
R1100  82  [0603-B-NOSILK]  109.1,53 0 top
R1103  61.9k  [0603-B-NOSILK]  14.9,41.3 270 top
R1104  10k  [0603-B-NOSILK]  13.4,41.3 90 top
R1105  100k  [0603-B-NOSILK]  51,83.4 270 top
R1106  10k  [0603-B-NOSILK]  112.28,57 180 top
R1107  15K  [0603-B-NOSILK]  13.6,7.8 0 bottom
R1108  15K  [0603-B-NOSILK]  13.6,12.5 0 bottom
R1109  15k  [0603-B-NOSILK]  3.2,30.8 270 bottom
R1110  15k  [0603-B-NOSILK]  3.2,34 90 bottom
TP1000  TEST  [TEST]  10.6,54.9 180 top
TP1001  TEST  [TEST]  26.1,62.1 180 top
TP1002  TEST  [TEST]  13.2,73.6 0 top
TP1003  TEST  [TEST]  12,54.9 180 top
TP1004  TEST  [TEST]  9.2,54.9 180 top
TP1005  TEST  [TEST]  13.4,54.9 180 top
TP1007  TEST  [TEST]  24.6,61 180 top
TP1008  TEST  [TEST]  17.6,44 0 top
TP1009  TEST  [TEST]  22.9,64.7 0 top
TP1010  TEST  [TEST]  24.5,63.4 0 top
TP1011  TEST  [TEST]  7.8,54.9 180 top
TP1015  TEST  [TEST]  83.5,35.5 270 top
TP1017  TEST  [TEST]  30.6,39.5 270 top
TP1019  TEST  [TEST]  93,34.7 270 top
TP1021  TEST  [TEST]  40.7,39.5 90 top
TP1023  TEST  [TEST]  82.9,36.3 270 top
TP1025  TEST  [TEST]  30.6,37.9 90 top
TP1027  TEST  [TEST]  92.4,35.5 270 top
TP1028  TEST  [TEST]  40.1,38.7 90 top
TP1030  TEST  [TEST]  83.5,37.1 270 top
TP1032  TEST  [TEST]  93,36.3 270 top
TP1034  TEST  [TEST]  82.9,37.9 270 top
TP1035  TEST  [TEST]  40.1,41.9 90 top
TP1037  TEST  [TEST]  93,37.9 270 top
TP1038  TEST  [TEST]  31.2,41.9 90 top
TP1040  TEST  [TEST]  82.9,39.5 270 top
TP1041  TEST  [TEST]  40.7,41.1 90 top
TP1043  TEST  [TEST]  92.4,38.7 270 top
TP1044  TEST  [TEST]  30.6,41.1 90 top
TP1046  TEST  [TEST]  83.5,40.3 270 top
TP1048  TEST  [TEST]  93,39.5 270 top
TP1050  TEST  [TEST]  82.9,41.1 270 top
TP1051  TEST  [TEST]  30.6,42.7 90 top
TP1054  TEST  [TEST]  30.6,44.3 90 top
TP1057  TEST  [TEST]  40.7,42.7 90 top
TP1060  TEST  [TEST]  40.7,44.3 90 top
TP1069  TEST  [TEST]  40.7,45.9 90 top
TP1072  TEST  [TEST]  40.1,45.1 90 top
TP1073  TEST  [TEST]  92.4,25.9 90 top
TP1076  TEST  [TEST]  30.6,45.9 90 top
TP1077  TEST  [TEST]  82.9,25.1 90 top
TP1080  TEST  [TEST]  31.2,45.1 90 top
TP1081  TEST  [TEST]  93,25.1 90 top
TP1083  TEST  [TEST]  40.7,25.1 90 top
TP1084  TEST  [TEST]  78.6,23.4 90 top
TP1089  TEST  [TEST]  40.7,47.5 90 top
TP1091  TEST  [TEST]  31.2,25.9 90 top
TP1092  TEST  [TEST]  82.9,34.7 90 top
TP1094  TEST  [TEST]  82.9,33.1 90 top
TP1096  TEST  [TEST]  40.1,48.3 90 top
TP1097  TEST  [TEST]  83.5,32.3 90 top
TP1099  TEST  [TEST]  40.7,26.7 90 top
TP1100  TEST  [TEST]  82.9,31.5 90 top
TP1102  TEST  [TEST]  30.6,26.7 90 top
TP1104  TEST  [TEST]  40.7,28.3 90 top
TP1105  TEST  [TEST]  31.2,46.7 90 top
TP1106  TEST  [TEST]  83.5,25.9 90 top
TP1108  TEST  [TEST]  31.2,27.5 90 top
TP1109  TEST  [TEST]  30.6,47.5 90 top
TP1110  TEST  [TEST]  82.9,26.7 90 top
TP1111  TEST  [TEST]  40.1,29.1 90 top
TP1112  TEST  [TEST]  93,28.3 90 top
TP1113  TEST  [TEST]  30.6,28.3 90 top
TP1114  TEST  [TEST]  92.4,29.1 90 top
TP1116  TEST  [TEST]  40.7,29.9 90 top
TP1117  TEST  [TEST]  40.7,49.1 90 top
TP1118  TEST  [TEST]  93,29.9 90 top
TP1120  TEST  [TEST]  30.6,29.9 90 top
TP1121  TEST  [TEST]  30.6,49.1 90 top
TP1122  TEST  [TEST]  83.5,27.5 90 top
TP1124  TEST  [TEST]  31.2,49.9 90 top
TP1125  TEST  [TEST]  82.9,28.3 90 top
TP1127  TEST  [TEST]  40.7,50.7 90 top
TP1128  TEST  [TEST]  93,31.5 90 top
TP1129  TEST  [TEST]  82.9,53.9 90 top
TP1131  TEST  [TEST]  92.4,32.3 90 top
TP1134  TEST  [TEST]  93,33.1 90 top
TP1137  TEST  [TEST]  83.5,30.7 90 top
TP1140  TEST  [TEST]  93,26.7 90 top
TP1142  TEST  [TEST]  82.9,29.9 90 top
TP1144  TEST  [TEST]  82.9,52.3 90 top
TP1146  TEST  [TEST]  83.5,51.5 90 top
TP1148  TEST  [TEST]  92.9,60.3 90 top
TP1151  TEST  [TEST]  83.5,59.5 90 top
TP1152  TEST  [TEST]  82.9,50.7 90 top
TP1154  TEST  [TEST]  92.9,58.7 90 top
TP1156  TEST  [TEST]  82.9,58.7 90 top
TP1158  TEST  [TEST]  40.7,37.9 90 top
TP1160  TEST  [TEST]  82.9,61.1 90 top
TP1161  TEST  [TEST]  31.2,37.1 90 top
TP1162  TEST  [TEST]  40.7,36.7 90 top
TP1163  TEST  [TEST]  30.6,36.3 90 top
TP1165  TEST  [TEST]  40.7,60.3 90 top
TP1166  TEST  [TEST]  31.2,60.3 90 top
TP1167  TEST  [TEST]  92.9,71.5 90 top
TP1169  TEST  [TEST]  40.1,61.1 90 top
TP1171  TEST  [TEST]  30.6,61.1 90 top
TP1179  TEST  [TEST]  40.1,83.5 90 top
TP1181  TEST  [TEST]  31.2,81.9 90 top
TP1183  TEST  [TEST]  40.7,82.7 90 top
TP1184  TEST  [TEST]  31.2,83.5 90 top
TP1186  TEST  [TEST]  30.6,81.1 90 top
TP1187  TEST  [TEST]  40.7,84.3 90 top
TP1189  TEST  [TEST]  40.7,81.1 90 top
TP1190  TEST  [TEST]  30.6,84.3 90 top
TP1192  TEST  [TEST]  30.6,79.5 90 top
TP1193  TEST  [TEST]  40.1,80.3 90 top
TP1194  TEST  [TEST]  30.6,82.7 90 top
TP1196  TEST  [TEST]  31.2,78.7 90 top
TP1199  TEST  [TEST]  40.7,79.5 90 top
TP1202  TEST  [TEST]  30.6,77.9 90 top
TP1205  TEST  [TEST]  40.7,77.9 90 top
TP1208  TEST  [TEST]  31.2,77.1 90 top
TP1210  TEST  [TEST]  40.1,77.1 0 top
TP1212  TEST  [TEST]  30.6,76.3 90 top
TP1214  TEST  [TEST]  40.7,76.3 90 top
TP1216  TEST  [TEST]  30.6,74.7 90 top
TP1217  TEST  [TEST]  40.7,74.7 90 top
TP1218  TEST  [TEST]  31.2,73.9 90 top
TP1219  TEST  [TEST]  40.1,73.9 90 top
TP1220  TEST  [TEST]  30.6,73.1 90 top
TP1221  TEST  [TEST]  40.7,73.1 90 top
TP1222  TEST  [TEST]  31.2,72.3 90 top
TP1223  TEST  [TEST]  40.7,71.5 90 top
TP1224  TEST  [TEST]  30.6,71.5 90 top
TP1225  TEST  [TEST]  95.99,77.07 90 top
TP1226  TEST  [TEST]  95.99,79.63 90 top
TP1227  TEST  [TEST]  100,57 90 bottom
TP1228  TEST  [TEST]  100,59 180 top
TVS1000  SMBJ18A  [SMB]  19.82,31.79 180 top
U1000  LT4619  [LT4619]  12.6,65.3 180 top
U1001  MAX5902AAETT  [SOT23-6]  17.6,41.3 0 top
U1002  TLV3012AIDBVT  [SOT23-6]  13.2,48.9 90 top
U1003  TLV3012AIDBVT  [SOT23-6]  6,45 90 top
U1004  [USB_PWR_SWT_SOP]  10.8,10.1 0 top
U1005  TUSB1106TSSOP  [USB_TRANCEIVER]  48.4,33.5 270 top
U1006  TUSB1106TSSOP  [USB_TRANCEIVER]  51.3,22.7 270 top
U1007  IC_NC7NP14  [MICROPAK-8]  54.1,50.7 0 top
U1008  IC_SN65HVD235  [DR-PDSO-G8]  47.1,50.2 270 top
U1009  SN74LVC2G80DCU  [SN74LVC2G80DCU]  95.3,73.1 0 top
U1010  SN74LS92D  [SN74LS92]  100.6,77.1 90 top
U1011  SN65220DBV  [SOT23-6L]  18.8,19.1 90 top
U1012  74LS244DW  [SO20W]  72.1,79.9 90 top
X1  IDE_CON_D  [IDE_CON_P]  106,27 90 top